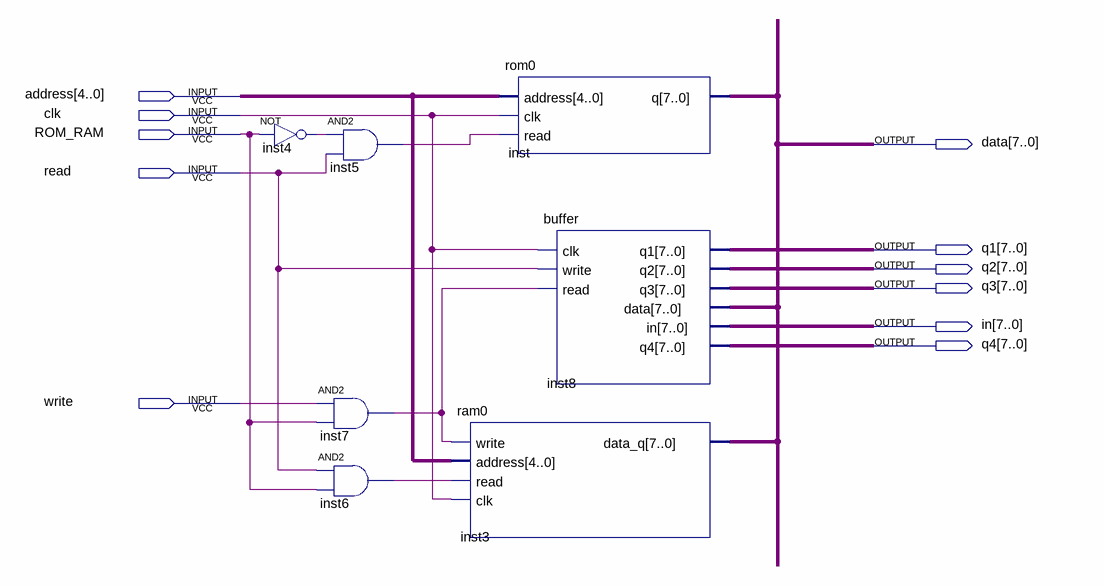
[diagram p0: schematic sheet]
// Quartus schematic Lab3.bdf as structural Verilog: 7 symbols, 11 pins
module Lab3 (
  input  [4:0] address,
  input  clk,
  input  ROM_RAM,
  input  read,
  input  write,
  output [7:0] data,
  output [7:0] q1,
  output [7:0] q2,
  output [7:0] q3,
  output [7:0] in,
  output [7:0] q4
);

  wire inst4_out, inst5_out, inst6_out, inst7_out;

  not inst4 (inst4_out, ROM_RAM);
  and inst5 (inst5_out, inst4_out, read);
  and inst7 (inst7_out, write, ROM_RAM);
  and inst6 (inst6_out, read, ROM_RAM);
  rom0 inst (.address(address), .clk(clk), .read(inst5_out), .q(data));
  ram0 inst3 (.write(inst7_out), .address(address), .read(inst6_out), .clk(clk), .data_q(data));
  buffer inst8 (.clk(clk), .write(read), .read(inst7_out), .q1(q1), .q2(q2), .q3(q3), .in(in), .q4(q4), .data(data));
endmodule
